# EasyEDA schematic SCH_sx28ice_2022-10-07.json
TITLE: ice f=tr based off v9kit diagram; REV: 1.0; Date: 2022-06-05; Sheet: 1/1; Company: Your Company
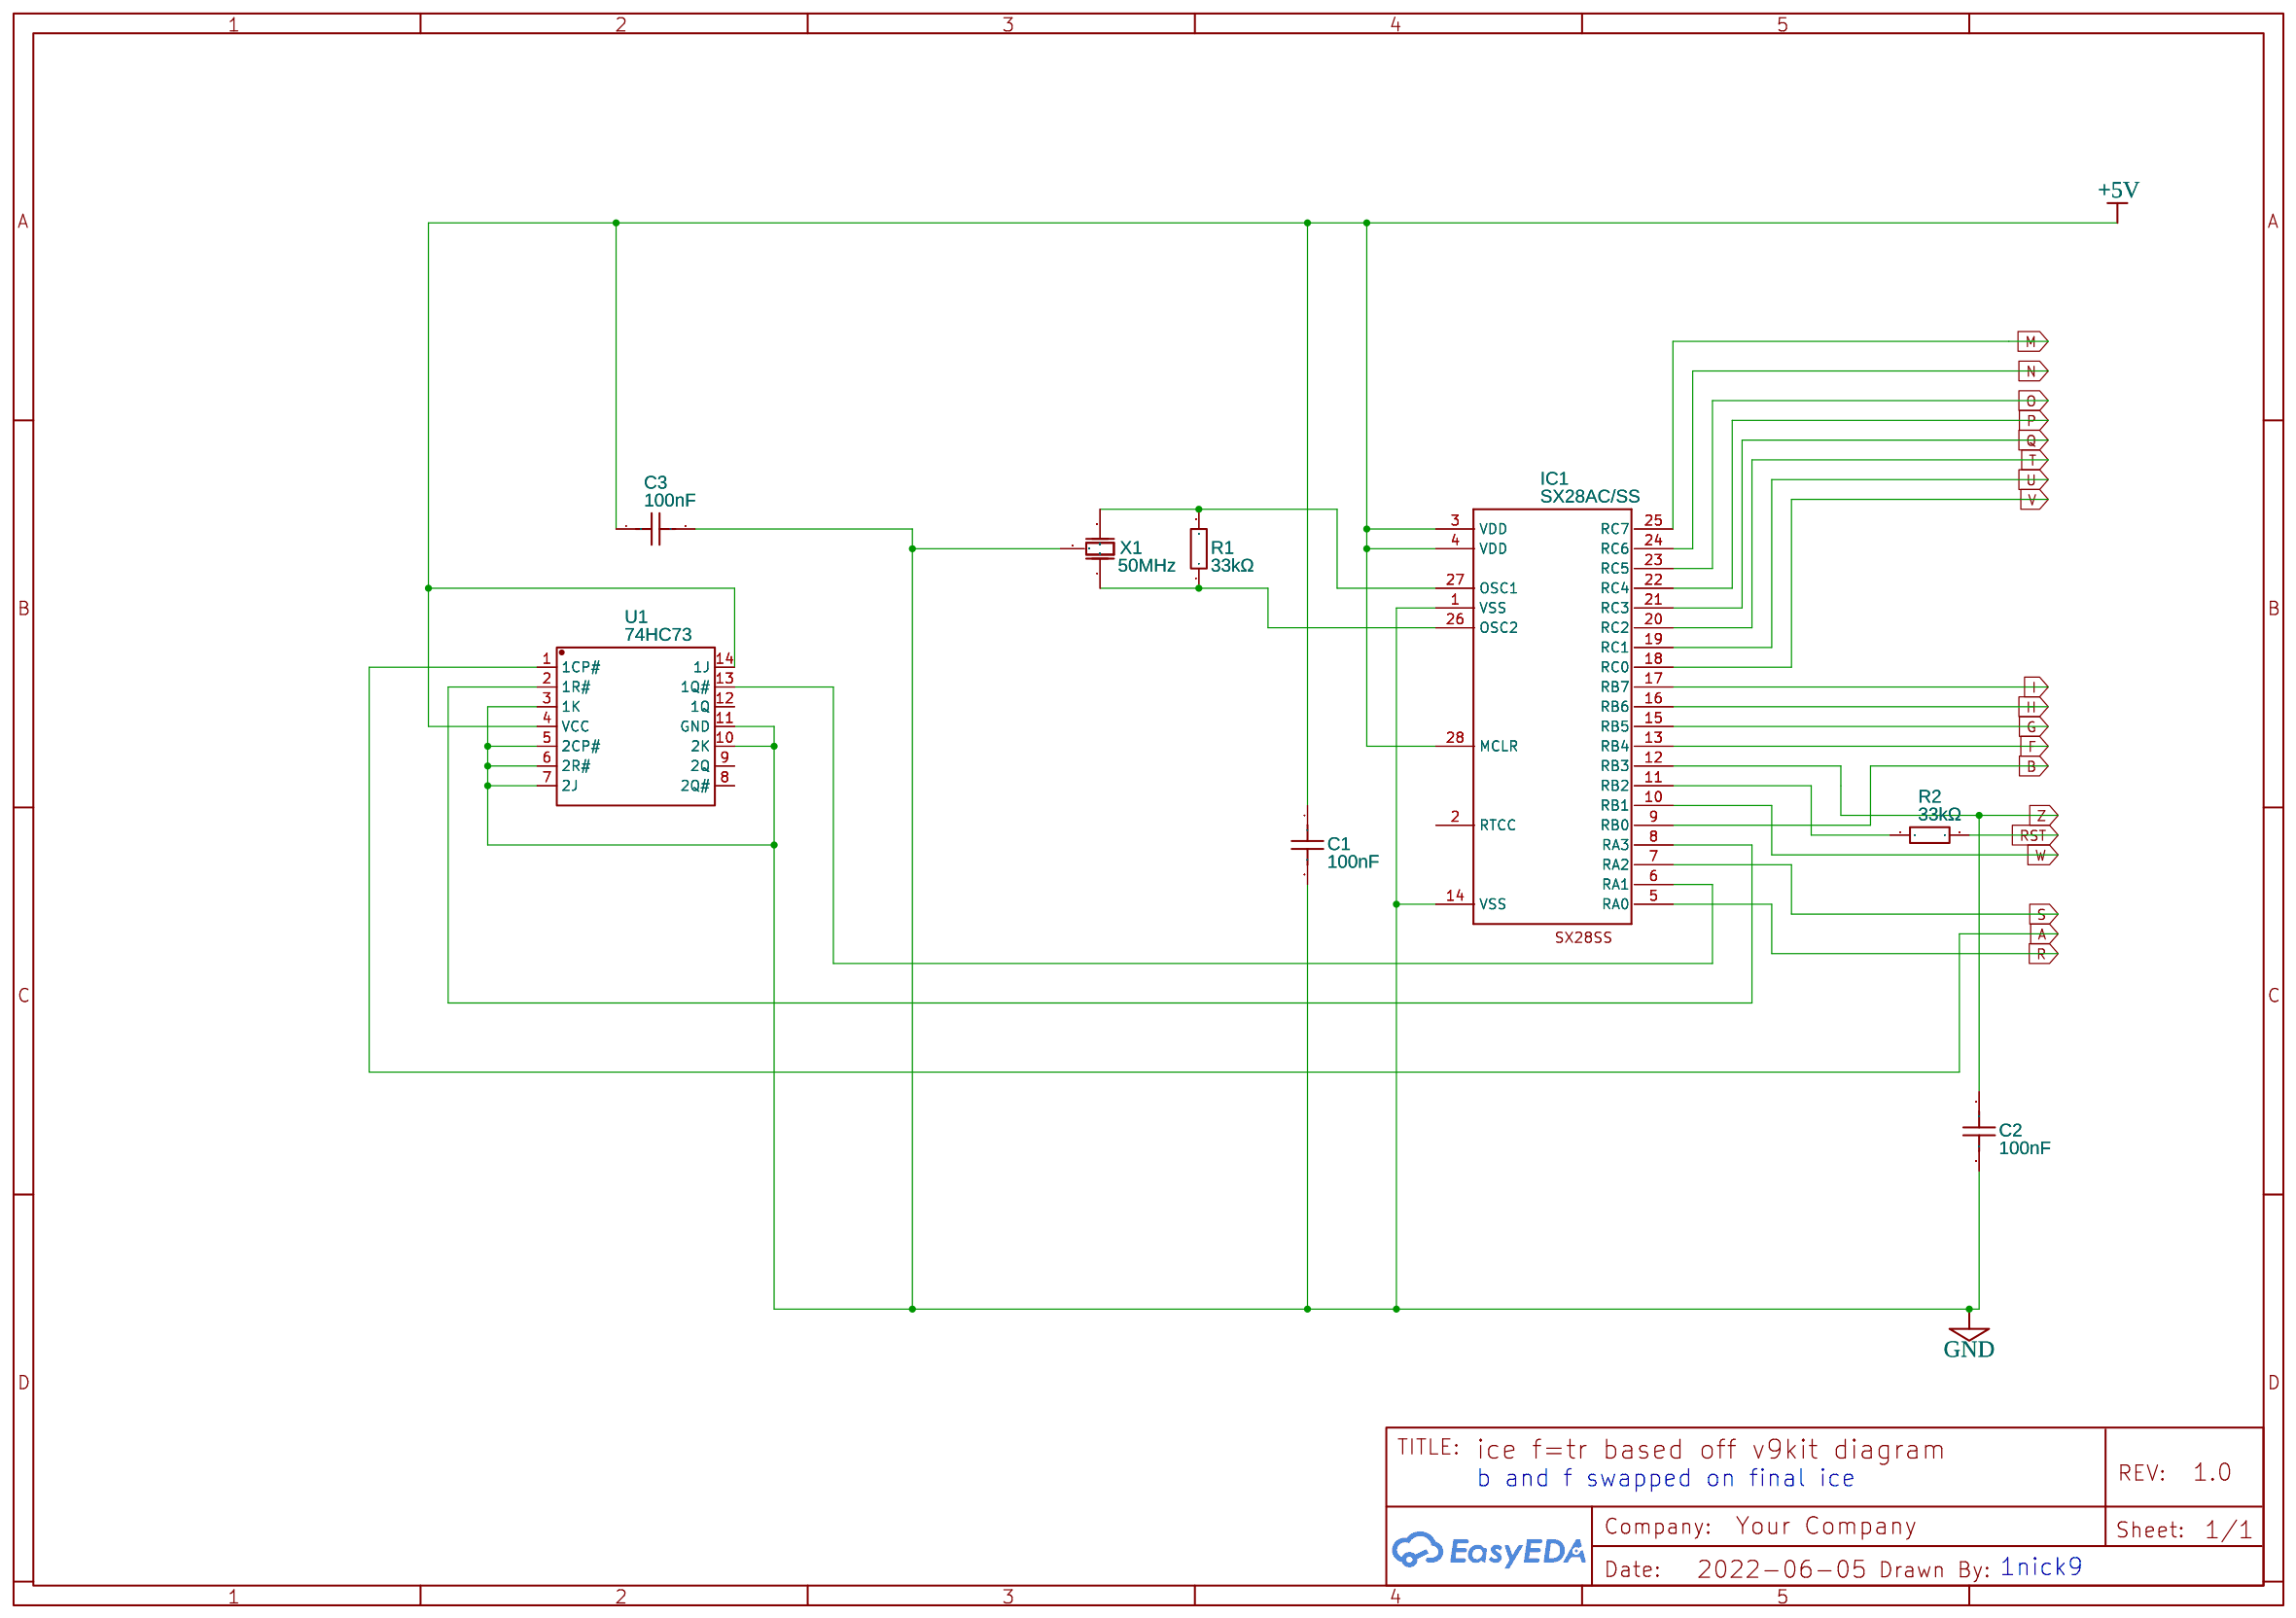
[diagram p0: schematic sheet]

## Parts
C1  100nF  [C0603]
C2  100nF  [C0603]
C3  100nF  [C0603]
IC1  SX28AC/SS  [28SS0P]
R1  33kΩ  [R0603]
R2  33kΩ  [R0603]
U1  74HC73  [SOIC-14_L8.7-W3.9-P1.27-LS6.0-BL]
X1  50MHz  [OSC-SMD_3P-L4.5-W2.0]

## Library data of the parts
C1-C3 = 0603B104K250NT: Supplier: LCSC; Supplier Part: C694249; Manufacturer: FH(风华); JLCPCB Part Class: Extended Part; Contributor: LCSC
IC1 = SX28AC/SS: Contributor: InductedNOW
R1 R2 = RMC060333K1%N: Supplier: LCSC; Supplier Part: C269485; Manufacturer: Tyohm; Resistance (Ohms): 33K; Contributor: LCSC; JLCPCB Part Class: Extended Part
U1 = CD74HC73M96: Supplier: LCSC; Supplier Part: C350539; Manufacturer: Texas Instruments; Contributor: LCSC; JLCPCB Part Class: Extended Part
X1 = CSTNR4M00GH5L000R0: Supplier: LCSC; Contributor: LCSC

## Nets
+5V: C1.1 C3.1 IC1.3(VDD) IC1.4(VDD) IC1.28(MCLR) U1.4(VCC) U1.14(1J)
GND: C1.2 C2.2 C3.2 IC1.1(VSS) IC1.14(VSS) U1.3(1K) U1.5(2CP#) U1.6(2R#) U1.7(2J) U1.10(2K) U1.11(GND) X1.2(GND)
A: U1.1(1CP#)
B: IC1.9(RB0)
F: IC1.13(RB4)
G: IC1.15(RB5)
H: IC1.16(RB6)
I: IC1.17(RB7)
M: IC1.25(RC7)
N: IC1.24(RC6)
O: IC1.23(RC5)
P: IC1.22(RC4)
Q: IC1.21(RC3)
R: IC1.5(RA0)
RST: R2.2
S: IC1.7(RA2)
T: IC1.20(RC2)
U: IC1.19(RC1)
V: IC1.18(RC0)
W: IC1.10(RB1)
Z: C2.1 IC1.12(RB3)
Net-(IC1-6): IC1.6(RA1) U1.13(1Q#)
Net-(IC1-8): IC1.8(RA3) U1.2(1R#)
Net-(IC1-11): IC1.11(RB2) R2.1
Net-(IC1-26): IC1.26(OSC2) R1.1 X1.1(OSC1)
Net-(IC1-27): IC1.27(OSC1) R1.2 X1.3(OSC2)

Not connected (* = marked no-connect by the designer): IC1 2(RTCC); U1 8(2Q#) 9(2Q) 12(1Q)

## Notes on the sheet
- b and f swapped on final ice
- 1nick9
